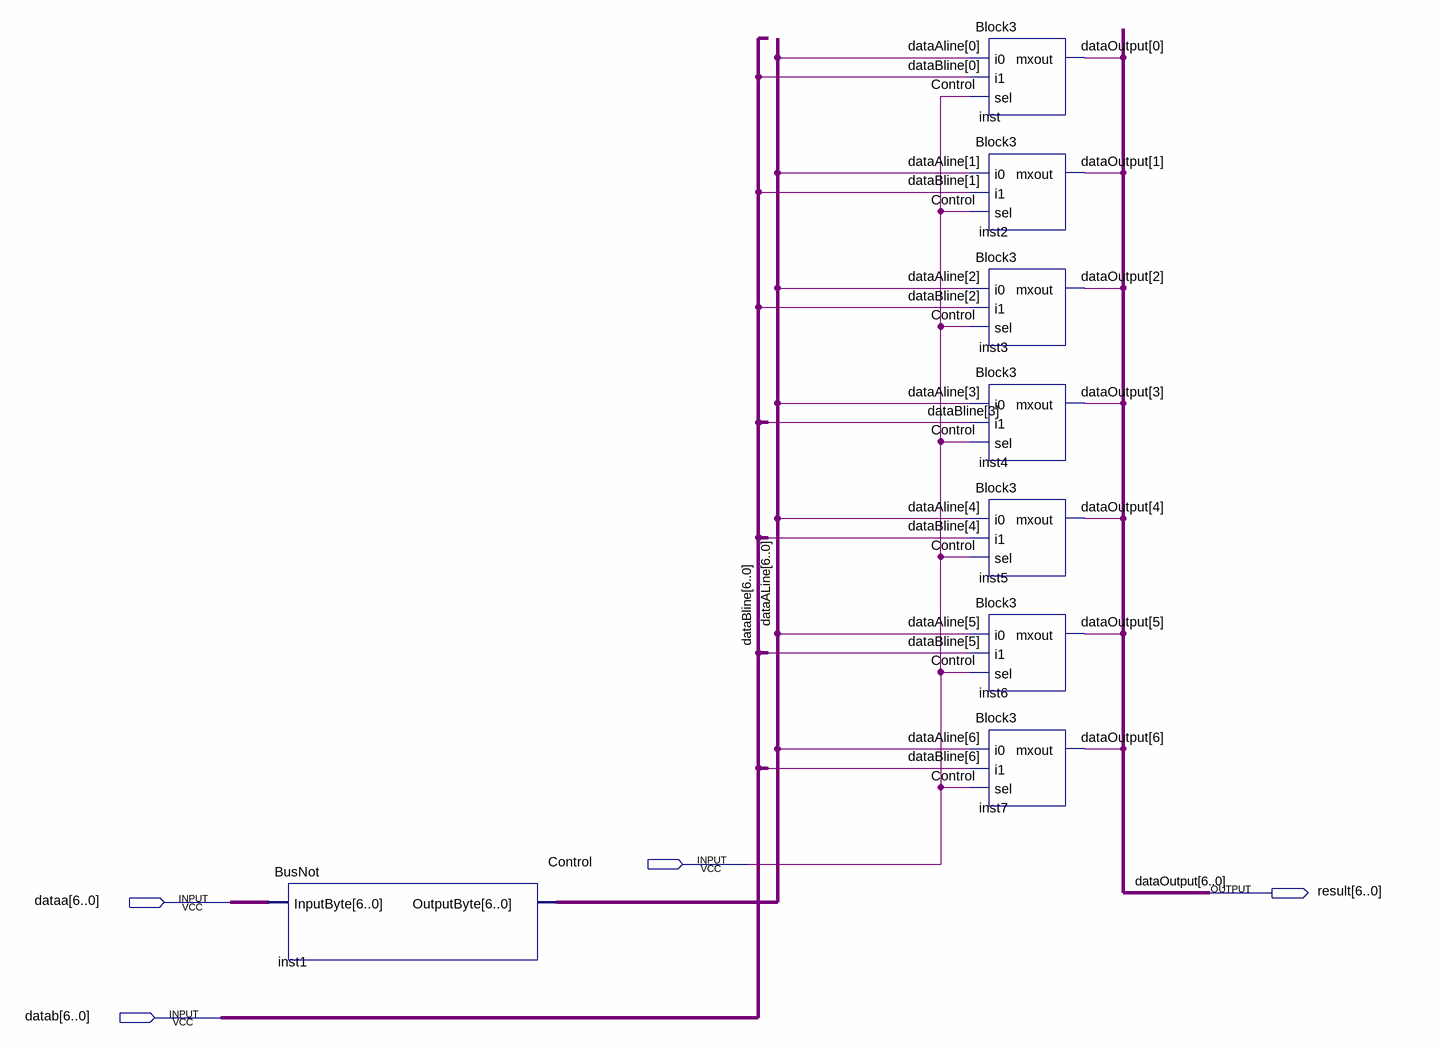
[diagram p0: schematic sheet]
// Quartus schematic 7WidWideBusMux.bdf as structural Verilog: 8 symbols, 4 pins
module \7WidWideBusMux  (
  input  Control,
  input  [6:0] dataa,
  input  [6:0] datab,
  output [6:0] result
);

  wire [6:0] dataAline;

  BusNot inst1 (.InputByte(dataa), .OutputByte(dataAline));
  Block3 inst (.i0(dataAline[0]), .i1(datab[0]), .sel(Control), .mxout(result[0]));
  Block3 inst2 (.i0(dataAline[1]), .i1(datab[1]), .sel(Control), .mxout(result[1]));
  Block3 inst3 (.i0(dataAline[2]), .i1(datab[2]), .sel(Control), .mxout(result[2]));
  Block3 inst4 (.i0(dataAline[3]), .i1(datab[3]), .sel(Control), .mxout(result[3]));
  Block3 inst5 (.i0(dataAline[4]), .i1(datab[4]), .sel(Control), .mxout(result[4]));
  Block3 inst6 (.i0(dataAline[5]), .i1(datab[5]), .sel(Control), .mxout(result[5]));
  Block3 inst7 (.i0(dataAline[6]), .i1(datab[6]), .sel(Control), .mxout(result[6]));

  // Other names for the same wires on the sheet: dataBline[6:0] = datab; dataOutput[6:0] = result
endmodule
